# EAGLE design BatManagement (EAGLE 9.6.2)
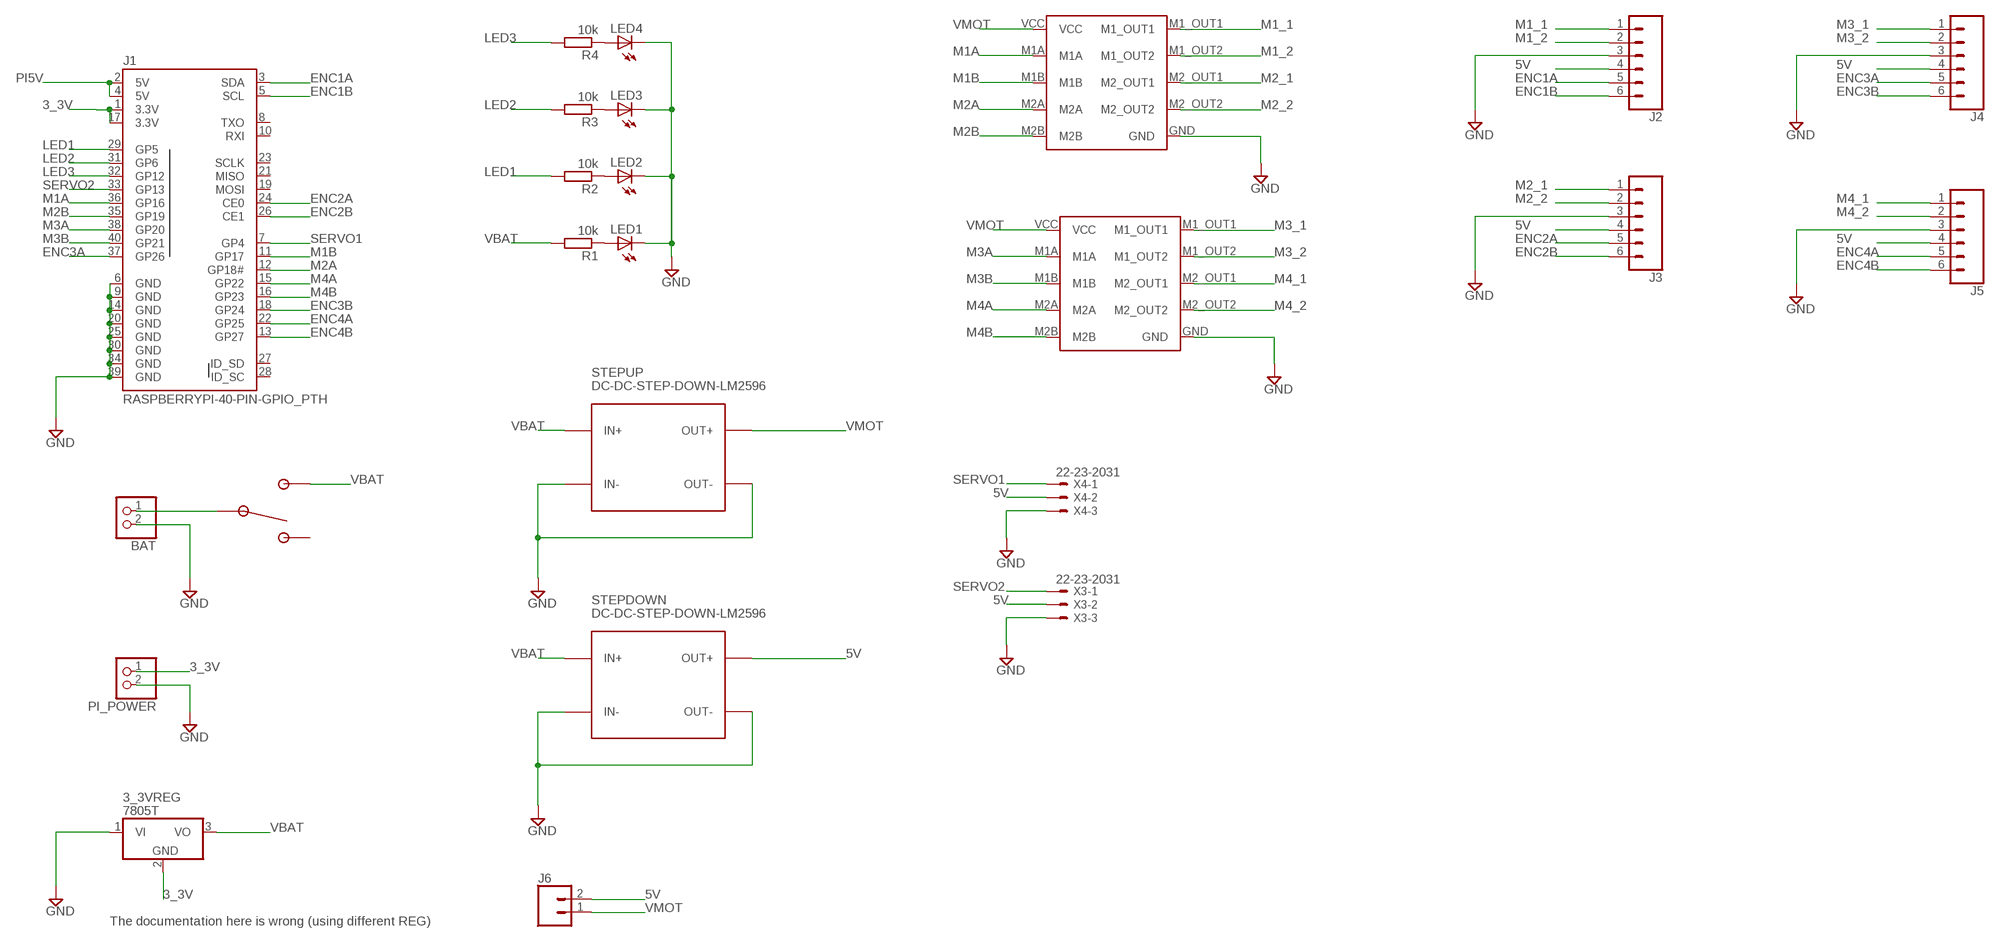
[diagram p0: schematic, sheet 1]

## Parts
3_3VREG  7805T  [TO220H]
BAT  JST_2PIN-THM  [JST-PH-2-THM]
J1  RASPBERRYPI-40-PIN-GPIO_PTH  [2X20_SHROUDED]
J2  CONN_06SILK_FEMALE_PTH  [1X06]
J3  CONN_06SILK_FEMALE_PTH  [1X06]
J4  CONN_06SILK_FEMALE_PTH  [1X06]
J5  CONN_06SILK_FEMALE_PTH  [1X06]
J6  CONN_02  [1X02]
LED1  LED5MM  [LED5MM]
LED2  LED5MM  [LED5MM]
LED3  LED5MM  [LED5MM]
LED4  LED5MM  [LED5MM]
MDRIVER1  LV8548MC_BOARD  [LV8548MC_BOARD]
MDRIVER2  LV8548MC_BOARD  [LV8548MC_BOARD]
PI_POWER  JST_2PIN-THM  [JST-PH-2-THM]
R1  10k  R-EU_0204/5  [0204/5]
R2  10k  R-EU_0204/5  [0204/5]
R3  10k  R-EU_0204/5  [0204/5]
R4  10k  R-EU_0204/5  [0204/5]
STEPDOWN  DC-DC-STEP-DOWN-LM2596  [DC-DC-STEP-DOWN-LM2596]
STEPUP  DC-DC-STEP-DOWN-LM2596  [DC-DC-STEP-DOWN-LM2596]
SW1  100SP1T2B4M6QE  [TOGGLE_RA]
X3  22-23-2031  [22-23-2031]
X4  22-23-2031  [22-23-2031]

## Nets
3_3V [Power]: 3_3VREG.2(GND) J1.1(3.3V) J1.17(3.3V) PI_POWER.1
5V [Power]: J2.4 J3.4 J4.4 J5.4 J6.2 STEPDOWN.OUT+ X3.2 X4.2
ENC1A: J1.3(SDA) J2.5
ENC1B: J1.5(SCL) J2.6
ENC2A: J1.24(CE0) J3.5
ENC2B: J1.26(CE1) J3.6
ENC3A: J1.37(GP26) J4.5
ENC3B: J1.18(GP24) J4.6
ENC4A: J1.22(GP25) J5.5
ENC4B: J1.13(GP27) J5.6
GND [Power]: 3_3VREG.1(VI) BAT.2 J1.6(GND) J1.9(GND) J1.14(GND) J1.20(GND) J1.25(GND) J1.30(GND) J1.34(GND) J1.39(GND) J2.3 J3.3 J4.3 J5.3 LED1.K(C) LED2.K(C) LED3.K(C) LED4.K(C) MDRIVER1.GND MDRIVER2.GND PI_POWER.2 STEPDOWN.IN- STEPDOWN.OUT- STEPUP.IN- STEPUP.OUT- X3.3 X4.3
LED1: J1.29(GP5) R2.2
LED2: J1.31(GP6) R3.2
LED3: J1.32(GP12) R4.2
M1_1: J2.1 MDRIVER1.M1_OUT1
M1_2: J2.2 MDRIVER1.M1_OUT2
M1A: J1.36(GP16) MDRIVER1.M1A
M1B: J1.11(GP17) MDRIVER1.M1B
M2_1: J3.1 MDRIVER1.M2_OUT1
M2_2: J3.2 MDRIVER1.M2_OUT2
M2A: J1.12(GP18#) MDRIVER1.M2A
M2B: J1.35(GP19) MDRIVER1.M2B
M3_1: J4.1 MDRIVER2.M1_OUT1
M3_2: J4.2 MDRIVER2.M1_OUT2
M3A: J1.38(GP20) MDRIVER2.M1A
M3B: J1.40(GP21) MDRIVER2.M1B
M4_1: J5.1 MDRIVER2.M2_OUT1
M4_2: J5.2 MDRIVER2.M2_OUT2
M4A: J1.15(GP22) MDRIVER2.M2A
M4B: J1.16(GP23) MDRIVER2.M2B
N$1: LED1.A R1.1
N$2: LED2.A R2.1
N$3: LED3.A R3.1
N$4: LED4.A R4.1
N$9 [Power]: BAT.1 SW1.2(COM)
PI5V: J1.2(5V) J1.4(5V)
SERVO1: J1.7(GP4) X4.1
SERVO2: J1.33(GP13) X3.1
VBAT [Power]: 3_3VREG.3(VO) R1.2 STEPDOWN.IN+ STEPUP.IN+ SW1.1
VMOT [Power]: J6.1 MDRIVER1.VCC MDRIVER2.VCC STEPUP.OUT+
Unconnected: J1.8(TXO) J1.10(RXI) J1.19(MOSI) J1.21(MISO) J1.23(SCLK) J1.27(ID_SD) J1.28(ID_SC) SW1.3

## Notes on the sheet
- The documentation here is wrong (using different REG)

## Library data of the parts
3_3VREG = linear:78*: Positive VOLTAGE REGULATOR Source: http://cache.national.com/ds/LM/LM78L05.pdf http://www.fairchildsemi.com/ds/LM/LM7805.pdf
BAT PI_POWER = adafruit:JST_2PIN: JST 2-Pin Connectors of various flavors SMT-RA (S2B-PH-SM4) 4UConnector #17311 SMT (B2B-PH-SM4) THM-RA (S2B-PH) THM (B2B-PH)
J1 = SparkFun-Connectors:RASPBERRYPI-40-PIN-GPIO: Raspberry Pi GPIO Header 2x20 pin connector, as found on B, B+, A+ models. Both shrouded PTH and SMT versions available. SparkFun Products: GPIO Shrouded Header <https://www.sparkfun.com/products/13054>- PTH SparkFun Pi Wedge (Preassembled) <https://www.sparkfun.com/products/13717>; PROD_ID: CONN-12263; SF_ID: PRT-13054
J2-J5 = SparkFun-Connectors:CONN_06: Multi connection point. Often used as Generic Header-pin footprint for 0.1 inch spaced/style header connections On any of the 0.1 inch spaced packages, you can populate with these: Break Away Headers - Straight <https://www.sparkfun.com/products/116> (PRT-00116) Break Away Male Headers - Right Angle <https://www.sparkfun.com/products/553> (PRT-00553) Female Headers <https://www.sparkfun.com/products/115> (PRT-00115) Break Away Headers - Machine Pin <https://www.sparkfun.com/products/117> (PRT-00117) Break Away Female Headers - Swiss Machine Pin <https://www.sparkfun.com/products/743> (PRT-00743) Arduino Stackable Header - 6 Pin <https://www.sparkfun.com/products/9280> (PRT-09280) For SCREWTERMINALS and SPRING TERMINALS visit here: Screw Terimnals on SparkFun.com <https://www.sparkfun.com/search/results?term=Screw+Terminals> (5mm/3.5mm/2.54mm spacing) This device is also useful as a general connection point to wire up your design to another part of your project. Our various solder wires solder well into these plated through hole pads. Hook-Up Wire - Assortment (Stranded, 22 AWG) <https://www.sparkfun.com/products/11375> (PRT-11375) Hook-Up Wire - Assortment (Solid Core, 22 AWG) <https://www.sparkfun.com/products/11367> (PRT-11367) View the entire wire category on our website here <https://www.sparkfun.com/categories/141>; PROD_ID: CONN-08437
J6 = SparkFun-Connectors:CONN_02: Multi connection point. Often used as Generic Header-pin footprint for 0.1 inch spaced/style header connections On any of the 0.1 inch spaced packages, you can populate with these: Break Away Headers - Straight <https://www.sparkfun.com/products/116> (PRT-00116) Break Away Male Headers - Right Angle <https://www.sparkfun.com/products/553> (PRT-00553) Female Headers <https://www.sparkfun.com/products/115> (PRT-00115) Break Away Headers - Machine Pin <https://www.sparkfun.com/products/117> (PRT-00117) Break Away Female Headers - Swiss Machine Pin <https://www.sparkfun.com/products/743> (PRT-00743) For SCREWTERMINALS and SPRING TERMINALS visit here: Screw Terimnals on SparkFun.com <https://www.sparkfun.com/search/results?term=Screw+Terminals> (5mm/3.5mm/2.54mm spacing) This device is also useful as a general connection point to wire up your design to another part of your project. Our various solder wires solder well into these plated through hole pads. Hook-Up Wire - Assortment (Stranded, 22 AWG) <https://www.sparkfun.com/products/11375> (PRT-11375) Hook-Up Wire - Assortment (Solid Core, 22 AWG) <https://www.sparkfun.com/products/11367> (PRT-11367) View the entire wire category on our website here <https://www.sparkfun.com/categories/141> Special notes: Molex polarized connector foot print use with: PRT-08233 with associated crimp pins and housings. 2.54_SCREWTERM for use with PRT-10571. 3.5mm Screw Terminal footprints for PRT-08084 5mm Screw Terminal footprints for use with PRT-08432
LED1-LED4 = adafruit:LED: LED OSRAM: - CHIPLED LG R971, LG N971, LY N971, LG Q971, LY Q971, LO R971, LY R971 LH N974, LH R974 LS Q976, LO Q976, LY Q976 LO Q996 - Hyper CHIPLED LW Q18S LB Q993, LB Q99A, LB R99A - SideLED LS A670, LO A670, LY A670, LG A670, LP A670 LB A673, LV A673, LT A673, LW A673 LH A674 LY A675 LS A676, LA A676, LO A676, LY A676, LW A676 LS A679, LY A679, LG A679 - Hyper Micro SIDELED® LS Y876, LA Y876, LO Y876, LY Y876 LT Y87S - SmartLED LW L88C, LW L88S LB L89C, LB L89S, LG L890 LS L89K, LO L89K, LY L89K LS L896, LA L896, LO L896, LY L896 - TOPLED LS T670, LO T670, LY T670, LG T670, LP T670 LSG T670, LSP T670, LSY T670, LOP T670, LYG T670 LG T671, LOG T671, LSG T671 LB T673, LV T673, LT T673, LW T673 LH T674 LS T676, LA T676, LO T676, LY T676, LB T676, LH T676, LSB T676, LW T676 LB T67C, LV T67C, LT T67C, LS T67K, LO T67K, LY T67K, LW E67C LS E67B, LA E67B, LO E67B, LY E67B, LB E67C, LV E67C, LT E67C LW T67C LS T679, LY T679, LG T679 LS T770, LO T770, LY T770, LG T770, LP T770 LB T773, LV T773, LT T773, LW T773 LH T774 LS E675, LA E675, LY E675, LS T675 LS T776, LA T776, LO T776, LY T776, LB T776 LHGB T686 LT T68C, LB T68C - Hyper Mini TOPLED® LB M676 - Mini TOPLED Santana® LG M470 LS M47K, LO M47K, LY M47K Source: http://www.osram.convergy.de/
MDRIVER1 MDRIVER2 = LV8548MCDriverBoard:LV8548MC_BOARD
R1-R4 = rcl:R-EU_: RESISTOR, European symbol; SPICEPREFIX: R
STEPDOWN STEPUP = diy-modules:DC-DC-STEP-DOWN-LM2596: DC/DC Step-Down Regulator based on LM2596-ADJ chip LM2596 datasheet available here: http://www.ti.com/lit/ds/symlink/lm2596.pdf Click here to find device on ebay.com <http://www.ebay.com/sch/lm2596+power+regulator>
SW1 = 100SP1T2B4M6QE:100SP1T2B4M6QE: Toggle Switch SPDT Through Hole, Right Angle 5A 120V Check prices <https://pricing.snapeda.com/parts/100SP1T2B4M6QE/E-Switch/view-part?ref=eda>; AVAILABILITY: Good; DESCRIPTION: Toggle Switch, 100 Series, SPDT, ON-NONE-ON, Sealed, 5A, 120VAC, 28VDC, R/A PC; MF: E-Switch; MP: 100SP1T2B4M6QE; PACKAGE: None; PRICE: None; PURCHASE-URL: https://pricing.snapeda.com/search/part/100SP1T2B4M6QE/?ref=eda
X3 X4 = con-molex:22-23-2031: .100" (2.54mm) Center Header - 3 Pin; MF: MOLEX; MPN: 22-23-2031; OC_FARNELL: 1462950; OC_NEWARK: 30C0862

## Net classes
0 default: width 0.3 mm, drill 0.25 mm, clearance 0.15 mm
1 Power: width 0.7 mm, drill 0.25 mm, clearance 0.15 mm

## Board
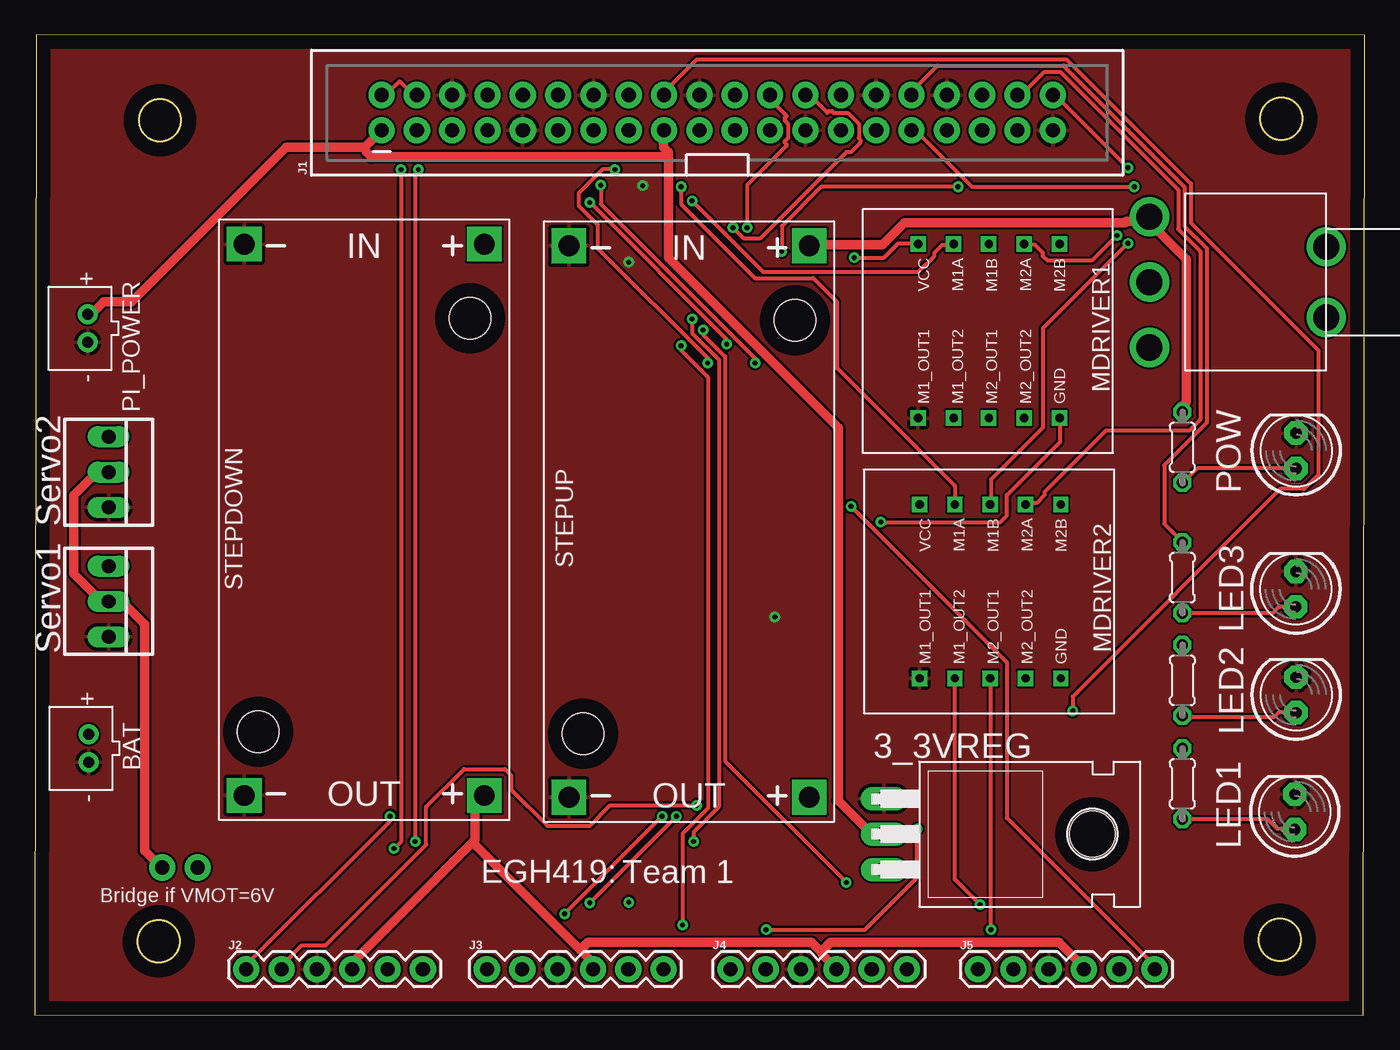
[diagram p1: board, top side]
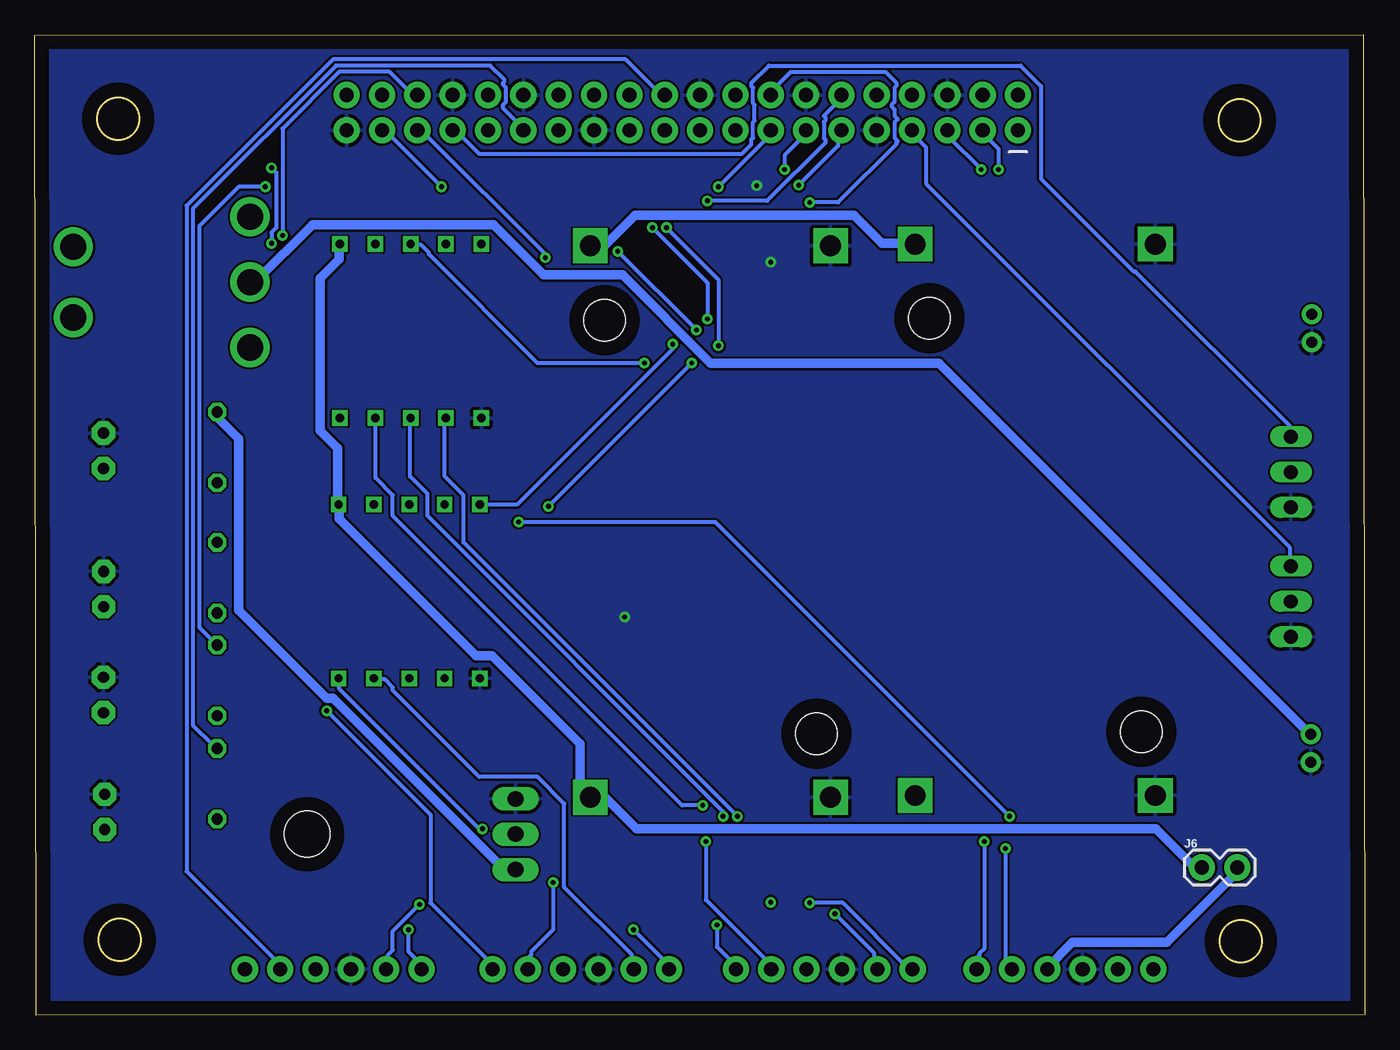
[diagram p2: board, bottom side, seen from below]

Size 95.6 x 70.44 mm. Coordinates in mm from the lower left corner, seen from the top.
Outline: 0,0.04 95.5,0 95.6,70.4 0.1,70.44 0,0.04
Outline: circle at 9,64.3 radius 1.5
Outline: circle at 89.5,5.4 radius 1.5
Outline: circle at 8.9,5.3 radius 1.5
Outline: circle at 89.6,64.4 radius 1.5
Copper layers (1*16): Top 0.035mm / dielectric 1.5mm / Bottom 0.035mm
Design rules "default": minimum track width 6mil, minimum drill 0.35mm, track to track 6mil, track to pad 6mil, pad to pad 6mil, via to via 6mil, smd to smd 6mil, copper to edge 40mil, drill to drill 6mil, minimum pad ring 10mil, minimum via ring 8mil, stop-mask expansion 4mil, vias tented up to drill 0mil, thermal gap 10mil

### Footprints (pad centres in the part's own frame; a part is rotated, then mirrored left to right if it is on the bottom)
TO220H = drill 1.118 long: 1 -2.54,-10.16; 2 0,-10.16; 3 2.54,-10.16 | hole 3.302: 0,4.826
JST-PH-2-THM = drill 0.8 pad 1.422: 1 1,0; 2 -1,0
2X20_SHROUDED = drill 1.016 pad 1.88: 1 -1.27,24.13; 2 1.27,24.13; 3 -1.27,21.59; 4 1.27,21.59; 5 -1.27,19.05; 6 1.27,19.05; 7 -1.27,16.51; 8 1.27,16.51; 9 -1.27,13.97; 10 1.27,13.97; 11 -1.27,11.43; 12 1.27,11.43; 13 -1.27,8.89; 14 1.27,8.89; 15 -1.27,6.35; 16 1.27,6.35; 17 -1.27,3.81; 18 1.27,3.81; 19 -1.27,1.27; 20 1.27,1.27; 21 -1.27,-1.27; 22 1.27,-1.27; 23 -1.27,-3.81; 24 1.27,-3.81; 25 -1.27,-6.35; 26 1.27,-6.35; 27 -1.27,-8.89; 28 1.27,-8.89; 29 -1.27,-11.43; 30 1.27,-11.43; 31 -1.27,-13.97; 32 1.27,-13.97; 33 -1.27,-16.51; 34 1.27,-16.51; 35 -1.27,-19.05; 36 1.27,-19.05; 37 -1.27,-21.59; 38 1.27,-21.59; 39 -1.27,-24.13; 40 1.27,-24.13
1X06 = drill 1.016 pad 1.88: 1 0,0; 2 2.54,0; 3 5.08,0; 4 7.62,0; 5 10.16,0; 6 12.7,0
1X02 = drill 1.016 pad 1.88: 1 0,0; 2 2.54,0
LED5MM = drill 0.813 pad 1.676 octagon: A -1.27,0; K 1.27,0
LV8548MC_BOARD = drill 0.6 square: GND 12.5,0; M1_OUT1 12.5,10.16; M1_OUT2 12.5,7.62; M1A 0,7.62; M1B 0,5.08; M2_OUT1 12.5,5.08; M2_OUT2 12.5,2.54; M2A 0,2.54; M2B 0,0; VCC 0,10.16
0204/5 = drill 0.813 octagon: 1 -2.54,0; 2 2.54,0
DC-DC-STEP-DOWN-LM2596 = drill 1.5 pad 2.5 square: IN+ -19.812,8.636; IN- -19.812,-8.636; OUT+ 19.812,8.636; OUT- 19.812,-8.636 | hole 3: -14.478,7.62; 15.24,-7.62
TOGGLE_RA = drill 1.88: 1 4.699,12.7; 2 0,12.7; 3 -4.699,12.7; P$4 -2.54,0; P$5 2.54,0
22-23-2031 = drill 1 long: 1 -2.54,0; 2 0,0; 3 2.54,0

### Placement (x,y rotation side)
3_3VREG  71.2,13 270 top
BAT  3.87,19.17 90 top
J1  49.05,64.84 90 top
J2  15.2,3.3 0 top
J3  32.5,3.3 0 top
J4  50,3.3 0 top
J5  67.8,3.3 0 top
J6  11.7,10.6 0 bottom
LED1  90.67,40.55 90 top
LED2  90.57,14.6 90 top
LED3  90.67,23 90 top
LED4  90.65,30.61 90 top
MDRIVER1  63.5,55.4 270 top
MDRIVER2  63.6,36.7 270 top
PI_POWER  3.81,49.35 90 top
R1  82.49,40.79 90 top
R2  82.49,16.62 90 top
R3  82.49,24.05 90 top
R4  82.49,31.43 90 top
STEPDOWN  23.68,35.59 270 top
STEPUP  47.03,35.46 270 top
SW1  92.83,52.67 90 top
X3  5.31,39.02 270 top
X4  5.31,29.72 270 top

### Tracks (layer width: path | path; a pad name or v marks a point on that pad's centre or on a via)
3_3V
  Top 0.7: 23.72,62.35 18.07,62.35 6.98,51.26 4.95,51.26 4.04,50.36 PI_POWER.1 | 23.72,62.35 24.86,63.48 J1.1 | 45.55,61.67 45.55,62.01 45.21,62.35 45.21,62.8 45.1,62.91 45.1,63.37 45.21,63.48 J1.17 | 45.55,61.67 45.55,54.43 57.77,42.22 57.77,15.41 60.14,13.04 60.93,13.04 3_3VREG.2 | 45.55,61.67 24.18,61.67 23.84,62.01 23.72,62.35
5V
  Top 0.7: X3.2 5.29,38.94 4.38,38.94 2.8,37.35 2.8,31.7 4.72,29.77 5.29,29.77 X4.2 5.63,29.66 6.31,29.66 7.89,28.08 7.89,11.79 9.13,10.55 J6.2 | 31.47,12.41 31.64,12.58 31.64,15.19 32.21,15.75 STEPDOWN.OUT+ | 31.47,12.41 22.93,3.88 22.93,3.31 J2.4 | 31.47,12.41 39.22,4.67 | 39.22,4.67 40.01,3.88 40.01,3.31 J3.4 | 56.64,4.44 56.64,4.33 57.2,3.76 57.2,3.65 57.54,3.31 J4.4 | 56.64,4.44 55.84,5.23 39.78,5.23 39.22,4.67 | J5.4 75.07,3.65 75.07,3.76 73.6,5.23 57.2,5.23 56.75,4.78 56.64,4.44
  Bottom 0.7: J6.2 9.25,10.55 9.25,10.21 14.22,5.23 21.01,5.23 22.93,3.31 J2.4
ENC1A  (via drill 0.35)
  Top 0.3: v26.32,60.77 26.32,12.47 v25.82,11.97
  Bottom 0.3: v25.82,11.97 25.82,4.05 25.42,3.65 25.42,3.31 J2.5 | v26.32,60.77 26.32,62.24 27.57,63.48 J1.3
ENC1B  (via drill 0.35)
  Top 0.3: v27.34,12.47 27.34,60.54 v27.57,60.77
  Bottom 0.3: v27.34,12.47 27.34,4.78 27.68,4.44 27.68,4.33 27.79,4.22 27.79,3.31 J2.6 | v27.57,60.77 29.94,63.14 29.94,63.48 J1.5
ENC2A  (via drill 0.35)
  Top 0.3: v47.36,12.47 47.36,13.15 49.17,14.96 49.17,47.08 47.25,49 v47.25,50.02 | v51.21,56.58 51.21,59.63 54.03,62.46 54.03,62.57 53.92,62.69 53.92,62.8 54.15,63.03 54.15,64.04 53.92,64.27 53.92,64.5 54.03,64.61 52.9,65.74 52.9,66.08 J1.24
  Bottom 0.3: v47.36,12.47 47.36,8.29 42.72,3.65 42.72,3.31 J3.5 | v47.25,50.02 47.25,52.62 v51.21,56.58
ENC2B  (via drill 0.35)
  Top 0.3: v46.57,6.48 46.57,13.04 48.38,14.85 48.38,45.84 46.46,47.76 v46.46,48.1 | v50.19,56.58 50.98,55.79 52.11,55.79 58.33,62.01 58.67,62.01 59.35,62.69 59.35,62.91 59.24,63.03 59.24,64.04 58.45,64.84 57.43,64.84 57.31,64.95 57.09,64.95 56.97,64.84 55.73,66.08 55.5,66.08 J1.26
  Bottom 0.3: v46.57,6.48 46.57,4.89 45.21,3.54 45.21,3.31 J3.6 | v46.46,48.1 46.46,52.85 v50.19,56.58
ENC3A  (via drill 0.35)
  Top 0.3: v58.33,9.53 49.62,18.24 49.62,47.31 48.04,48.89 v48.04,49.23 | v53.7,54.88 53.7,56.69 56.52,59.52 v66.36,59.52
  Bottom 0.3: v58.33,9.53 58.33,6.14 59.92,4.55 59.92,4.33 60.14,4.1 60.14,3.31 J4.5 | v53.7,54.88 v48.04,49.23 | v66.36,59.52 70.32,63.48 70.55,63.48 J1.37
ENC3B  (via drill 0.35)
  Top 0.3: v74.62,21.86 74.62,22.88 89.55,37.8 91.24,37.8 92.26,38.82 92.26,47.76 83.1,56.92 83.1,59.75 74.17,68.68 47.59,68.68 45.33,66.42 45.33,66.19 J1.18
  Bottom 0.3: v74.62,21.86 67.15,14.39 67.15,8.06 62.74,3.65 62.74,3.31 J4.6
ENC4A
  Bottom 0.3: J5.5 78.01,3.31 78.01,3.65 84.68,10.32 84.68,58.16 74.17,68.68 53.13,68.68 50.64,66.19 50.41,66.19 J1.22
ENC4B  (via drill 0.35)
  Top 0.3: v58.67,36.56 69.87,25.36 69.87,14.17 80.5,3.54 J5.6 | v48.38,46.85 48.38,47.19 40.46,55.11 40.46,56.81 39.1,58.16 39.1,59.07 40.8,60.77 v41.71,60.77
  Bottom 0.3: v48.38,46.85 v58.67,36.56 | v41.71,60.77 41.71,61.78 40.24,63.25 40.24,63.48 J1.13
GND  (via drill 0.35)
  other vias: 53.2,28.6 42.7,54.1 43.7,59.6
  pour Top: -7.5,-0.1 -7.5,66.4 2,75.9 144.4,75.9 155.7,64.6 155.7,-0.9 143.7,-12.9 5.3,-12.9
  pour Bottom: -13,61.4 1.5,75.9 152.9,75.9 162.2,66.6 162.2,11.6 136.5,-14.1 1.5,-14.1 -13,0.4
LED1
  Bottom 0.3: R2.2 82.54,19.26 82.76,19.48 82.88,19.48 84.23,20.84 84.23,57.94 73.94,68.23 62.86,68.23 61.84,67.21 61.84,67.1 61.95,66.99 61.95,66.87 61.72,66.65 61.72,65.63 61.95,65.4 61.95,65.18 60.37,63.59 J1.29
LED2  (via drill 0.35)
  Top 0.3: v79.03,59.52 67.38,59.52 63.42,63.48 63.08,63.48 J1.31
  Bottom 0.3: v79.03,59.52 80.95,59.52 83.78,56.69 83.78,27.85 82.54,26.61 R3.2
LED3
  Top 0.3: R4.2 82.42,34.07 81.18,35.32 81.18,39.5 84.23,42.56 84.23,55.11 82.65,56.69 82.65,59.52 73.94,68.23 64.89,68.23 63.08,66.42 63.08,66.19 J1.32
M1_1  (via drill 0.35)
  Top 0.3: v60.82,35.43 69.42,35.43 69.87,35.88 69.87,37.35 73.71,41.2 73.71,42.9 MDRIVER1.M1_OUT1 | v25.53,14.28 25.53,13.94 15.24,3.65 15.24,3.31 J2.1
  Bottom 0.3: v60.82,35.43 46.68,35.43 v25.53,14.28
M1_2  (via drill 0.35)
  Top 0.3: v47.59,15.07 41.37,15.07 39.9,13.6 36.84,13.6 34.24,16.2 34.24,17.22 33.79,17.67 30.85,17.67 28.13,14.96 28.13,12.25 20.9,5.01 19.2,5.01 17.84,3.65 17.84,3.31 J2.2
  Bottom 0.3: v47.59,15.07 49.06,15.07 69.87,35.88 69.87,37.35 71.11,38.6 MDRIVER1.M1_OUT2
M1A  (via drill 0.35)
  Top 0.3: v77.78,56.02 75.98,54.21 72.81,54.21 72.47,54.54 72.47,54.77 71.9,55.34 71.23,55.34 MDRIVER1.M1A
  Bottom 0.3: v77.78,56.02 77.78,63.71 73.71,67.78 70.09,67.78 68.51,66.19 68.17,66.19 J1.36
M1B  (via drill 0.35)
  Top 0.3: v51.77,46.85 51.77,47.19 40.69,58.28 v40.69,59.63
  Bottom 0.3: v51.77,46.85 59.46,46.85 67.27,54.66 67.27,54.77 67.83,55.34 68.51,55.34 MDRIVER1.M1B | v40.69,59.63 37.86,62.46 37.86,62.69 37.63,62.91 37.63,63.48 J1.11
M2_1  (via drill 0.35)
  Top 0.3: v39.9,8.06 v46.12,14.28
  Bottom 0.3: v46.12,14.28 46.12,14.62 67.38,35.88 67.38,37.47 68.62,38.71 68.62,42.9 MDRIVER1.M2_OUT1 | v39.9,8.06 37.52,8.06 32.77,3.31 32.55,3.31 J3.1
M2_2  (via drill 0.35)
  Top 0.3: v38.09,7.27 v45.1,14.28
  Bottom 0.3: v45.1,14.28 64.78,33.96 64.78,37.35 66.14,38.71 66.14,42.9 MDRIVER1.M2_OUT2 | v38.09,7.27 35.26,4.44 35.26,4.22 35.15,4.1 35.15,3.31 J3.2
M2A  (via drill 0.35)
  Top 0.3: v47.25,58.5 52.34,53.41 63.53,53.41 64.67,54.54 64.67,54.77 65.23,55.34 66.02,55.34 MDRIVER1.M2A
  Bottom 0.3: v47.25,58.5 42.95,58.5 38.77,62.69 38.77,62.91 38.88,63.03 38.88,64.16 38.77,64.27 38.77,64.5 38.88,64.61 37.63,65.85 37.63,66.08 J1.12
M2B  (via drill 0.35)
  Top 0.3: v58.9,54.43 61.05,54.43 62.06,55.45 63.42,55.45 MDRIVER1.M2B
  Bottom 0.3: v58.9,54.43 58.9,54.66 67.72,63.48 68.06,63.48 J1.35
M3_1  (via drill 0.35)
  Top 0.3: v63.42,13.38 63.42,9.87 59.69,6.14 v52.56,6.14
  Bottom 0.3: v63.42,13.38 63.65,13.38 73.71,23.44 73.71,24.12 MDRIVER2.M1_OUT1 | v52.56,6.14 50.08,3.65 50.08,3.31 J4.1
M3_2
  Bottom 0.3: MDRIVER2.M1_OUT2 71.11,24.12 70.43,24.12 69.87,23.55 69.87,23.33 63.65,17.11 59.46,17.11 57.54,15.19 57.54,9.19 52.68,4.33 52.68,4.22 52.56,4.1 52.56,3.31 J4.2
M3A
  Top 0.3: MDRIVER2.M1A 71.23,36.79 72.02,36.79 72.58,37.35 72.58,37.58 76.99,41.99 82.99,41.99 83.78,42.78 83.78,54.88 82.2,56.47 82.2,59.29 73.71,67.78 72.58,67.78 71,66.19 70.66,66.19 J1.38
M3B  (via drill 0.35)
  Top 0.3: v78.58,55.45 72.47,49.34 72.47,42.22 68.74,38.48 68.74,36.79 MDRIVER2.M1B | v78.58,60.88 73.26,66.19 J1.40
  Bottom 0.3: v78.58,55.45 78.58,56.24 78.24,56.58 78.24,60.54 v78.58,60.88
M4_1  (via drill 0.35)
  Top 0.3: v68.74,6.14 68.74,24.12 MDRIVER2.M2_OUT1
  Bottom 0.3: v68.74,6.14 68.74,4.55 67.83,3.65 67.83,3.31 J5.1
M4_2  (via drill 0.35)
  Top 0.3: v67.95,7.95 66.14,9.76 66.14,24.12 MDRIVER2.M2_OUT2
  Bottom 0.3: v67.95,7.95 69.87,6.02 69.87,4.67 70.21,4.33 70.21,4.22 70.32,4.1 70.32,3.31 J5.2
M4A  (via drill 0.35)
  Top 0.3: v46.46,59.52 46.46,58.28 51.77,52.96 55.96,52.96 57.65,51.26 57.65,46.51 66.14,38.03 66.14,36.79 MDRIVER2.M2A
  Bottom 0.3: v46.46,59.52 42.72,63.25 42.72,63.48 J1.15
M4B  (via drill 0.35)
  Top 0.3: v49.74,48.21 49.74,48.55 v39.9,58.39
  Bottom 0.3: v49.74,48.21 49.74,47.87 60.93,36.67 63.53,36.67 MDRIVER2.M2B | v39.9,58.39 37.86,58.39 33.68,62.57 33.68,62.69 33.56,62.8 33.79,63.03 33.79,64.16 33.56,64.38 33.79,64.61 33.79,65.06 34.02,65.29 34.02,65.4 33.79,65.63 33.79,66.65 33.68,66.76 33.68,66.99 34.47,67.78 41.25,67.78 42.61,66.42 42.61,66.19 J1.16
N$1
  Top 0.3: R1.1 82.54,38.26 83.55,39.28 90.57,39.28 LED1.A
N$2
  Top 0.3: R2.1 82.54,14.05 88.64,14.05 89.32,13.38 90.57,13.38 LED2.A
N$3
  Top 0.3: R3.1 82.54,21.41 89.09,21.41 89.44,21.75 90.57,21.75 LED3.A
N$4
  Top 0.3: R4.1 82.54,28.87 88.98,28.87 89.44,29.32 90.57,29.32 LED4.A
N$5  (via drill 0.35)
  other vias: 42.7,8.1
N$9
  Bottom 0.7: BAT.1 3.93,20.27 4.04,20.27 30.62,46.85 47.02,46.85 53.36,53.19 59.01,53.19 62.63,56.81 75.64,56.81 79.71,52.74 80.05,52.74 SW1.2
PI5V
  Top 0.3: J1.2 24.97,66.19 25.31,66.19 26.21,67.1 27.12,66.19 27.46,66.19 J1.4
SERVO1
  Bottom 0.3: X4.1 5.4,32.26 5.4,33.62 31.53,59.75 31.53,62.35 32.43,63.25 32.43,63.48 J1.7
SERVO2
  Bottom 0.3: X3.1 5.4,41.65 5.4,42.33 16.48,53.41 16.6,53.41 23.27,60.09 23.27,66.76 24.74,68.23 42.84,68.23 44.08,66.99 44.08,66.76 43.97,66.65 43.97,65.52 43.85,65.4 43.85,64.27 43.97,64.16 43.97,63.03 44.08,62.91 44.08,62.57 44.76,61.9 63.65,61.9 65.23,63.48 65.46,63.48 J1.33
VBAT
  Top 0.7: R1.2 82.54,43.35 82.54,43.8 82.76,44.03 82.76,54.32 80.16,56.92 80.16,57.26 SW1.1 79.82,57.26 79.03,57.26 78.8,57.03 78.46,57.03 78.35,56.92 62.52,56.92 60.93,55.34 55.73,55.34 STEPUP.IN+
  Bottom 0.7: STEPDOWN.IN+ 32.32,55.45 34.69,55.45 36.73,57.49 52.45,57.49 54.71,55.22 55.62,55.22 STEPUP.IN+ | 3_3VREG.3 61.05,10.55 61.95,10.55 74.17,22.76 74.62,22.76 80.95,29.1 80.95,41.43 82.54,43.01 82.54,43.23 R1.2
VMOT
  Bottom 0.7: MDRIVER1.VCC 73.71,55.34 73.71,54.32 75.07,52.96 75.07,41.99 73.83,40.75 73.83,36.79 MDRIVER2.VCC 73.71,36.45 73.71,35.66 63.87,25.82 62.74,25.82 56.41,19.48 56.41,16.54 55.84,15.98 STEPUP.OUT+ 55.62,15.75 54.71,15.75 52.34,13.38 15.01,13.38 12.3,10.66 11.73,10.66 J6.1

### Text on the board
tNames: POW | Servo2 | LED3 | Servo1 | LED2 | LED1 | EGH419: | Team 1 | Bridge if VMOT=6V
200bmp: C:/Users/CodyS/OneDrive - Queensland University of Technology/Uni Coursework/2021/EGH419 Group 1 Shared Folder/Git Stuff/EGH419/LOGO.bmp